# EAGLE design vip (EAGLE 4.15)
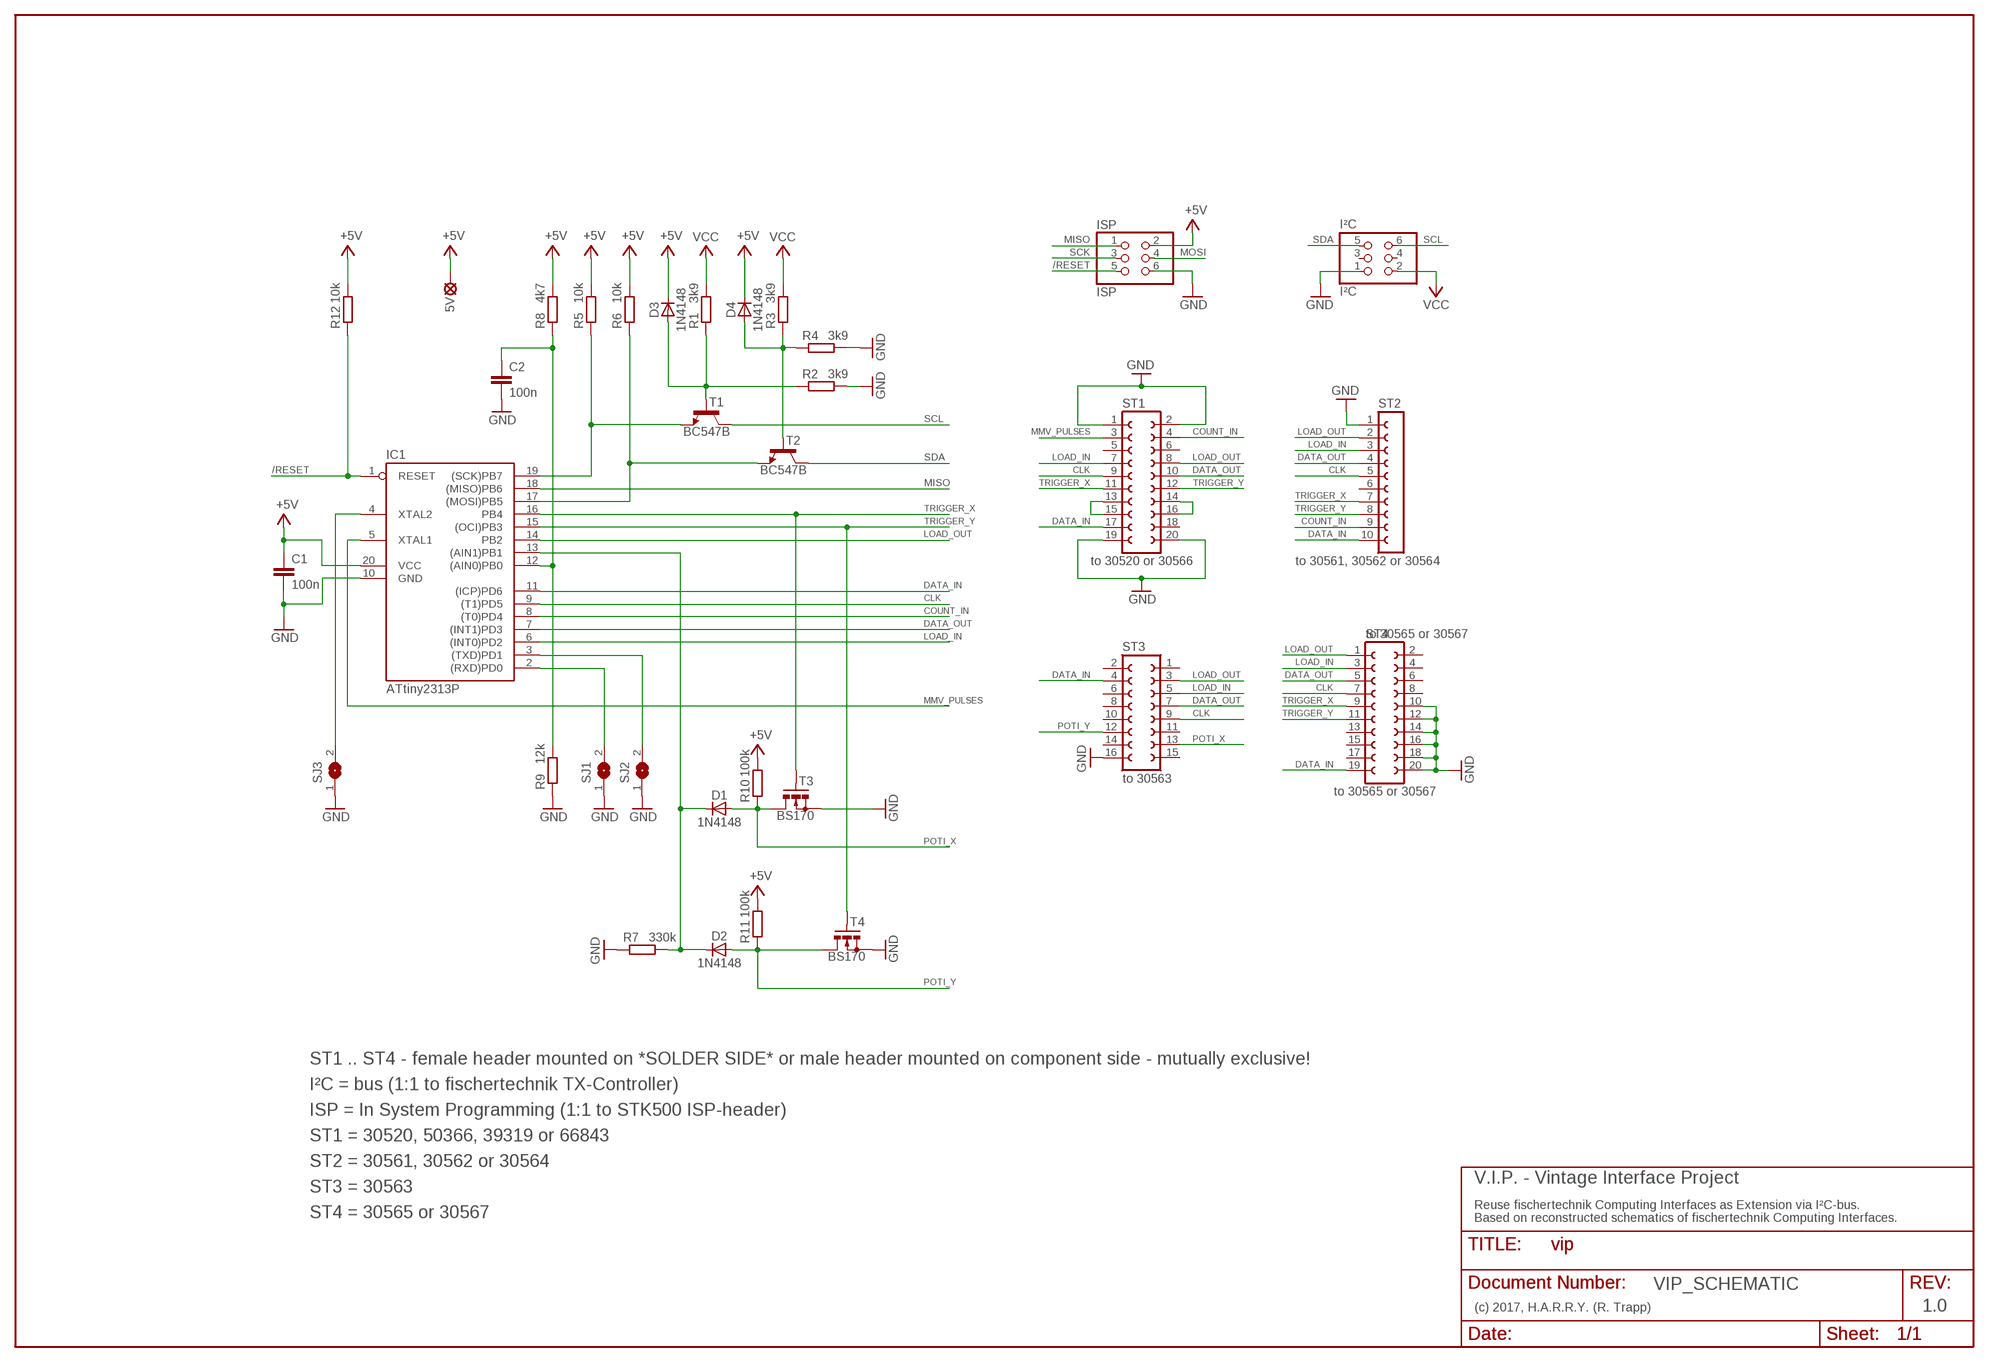
[diagram p0: schematic, sheet 1]

## Parts
5V  LSP10  [LSP10]
C1  100n  C-EU050-024X044  [C050-024X044]
C2  100n  C-EU050-024X044  [C050-024X044]
D1  1N4148  DIODE-D-5  [D-5]
D2  1N4148  DIODE-D-5  [D-5]
D3  1N4148  DIODE-D-5  [D-5]
D4  1N4148  DIODE-D-5  [D-5]
IC1  ATtiny2313P  AT90S2313P  [DIL20]
ISP  ISP  PINHD-2X3_2.54  [2X03]
I²C  I²C  PINHD-2X3_2.54-90°  [2X03/90]
R1  3k9  R-EU_0204/5  [0204/5]
R2  3k9  R-EU_0204/5  [0204/5]
R3  3k9  R-EU_0204/5  [0204/5]
R4  3k9  R-EU_0204/5  [0204/5]
R5  10k  R-EU_0204/5  [0204/5]
R6  10k  R-EU_0204/5  [0204/5]
R7  330k  R-EU_0204/5  [0204/5]
R8  4k7  R-EU_0204/5  [0204/5]
R9  12k  R-EU_0204/5  [0204/5]
R10  100k  R-EU_0204/5  [0204/5]
R11  100k  R-EU_0204/5  [0204/5]
R12  10k  R-EU_0204/2V  [0204V]
SJ1  SJ  [SJ]
SJ2  SJ  [SJ]
SJ3  SJ  [SJ]
ST1  to 30520 or 30566  FE10-2  [FE10-2]
ST2  to 30561, 30562 or 30564  FE10-1  [FE10]
ST3  to 30563  FE08-2  [FE08-2]
ST4  to 30565 or 30567  FE10-2  [FE10-2]
T1  BC547B  [TO92]
T2  BC547B  [TO92]
T3  BS170  [SOT54E]
T4  BS170  [SOT54E]

## Nets
+5V: 5V.MP C1.1 D3.C D4.C IC1.20(VCC) ISP.2 R5.2 R6.2 R8.2 R10.2 R11.2 R12.2
/RESET: IC1.1(RESET) ISP.5 R12.1
CLK: IC1.9((T1)PD5) ST1.9 ST2.5 ST3.9 ST4.7
COUNT_IN: IC1.8((T0)PD4) ST1.4 ST2.9
DATA_IN: IC1.11((ICP)PD6) ST1.17 ST2.10 ST3.4 ST4.19
DATA_OUT: IC1.7((INT1)PD3) ST1.10 ST2.4 ST3.7 ST4.5
GND: C1.2 C2.2 IC1.10(GND) ISP.6 I²C.1 R2.2 R4.2 R7.1 R9.1 SJ1.1 SJ2.1 SJ3.1 ST1.1 ST1.2 ST1.19 ST1.20 ST2.1 ST3.16 ST4.10 ST4.12 ST4.14 ST4.16 ST4.18 ST4.20 T3.S T4.S
LOAD_IN: IC1.6((INT0)PD2) ST1.7 ST2.3 ST3.5 ST4.3
LOAD_OUT: IC1.14(PB2) ST1.8 ST2.2 ST3.3 ST4.1
MISO: IC1.18((MISO)PB6) ISP.1
MMV_PULSES: IC1.5(XTAL1) ST1.3
MOSI: IC1.17((MOSI)PB5) ISP.4 R6.1 T2.1(E)
N$1: D3.A R1.1 R2.1 T1.2(B)
N$2: D4.A R3.1 R4.1 T2.2(B)
N$3: IC1.4(XTAL2) SJ3.2
N$4: IC1.2((RXD)PD0) SJ1.2
N$5: D1.C D2.C IC1.13((AIN1)PB1) R7.2
N$6: IC1.3((TXD)PD1) SJ2.2
N$7: ST1.13 ST1.15
N$8: C2.1 IC1.12((AIN0)PB0) R8.1 R9.2
N$9: ST1.14 ST1.16
POTI_X: D1.A R10.1 ST3.13 T3.D
POTI_Y: D2.A R11.1 ST3.12 T4.D
SCK: IC1.19((SCK)PB7) ISP.3 R5.1 T1.1(E)
SCL: I²C.5 T1.3(C)
SDA: I²C.6 T2.3(C)
TRIGGER_X: IC1.16(PB4) ST1.11 ST2.7 ST4.9 T3.G
TRIGGER_Y: IC1.15((OCI)PB3) ST1.12 ST2.8 ST4.11 T4.G
VCC: I²C.2 R1.2 R3.2
Unconnected: I²C.3 I²C.4 ST1.5 ST1.6 ST1.18 ST2.6 ST3.1 ST3.2 ST3.6 ST3.8 ST3.10 ST3.11 ST3.14 ST3.15 ST4.2 ST4.4 ST4.6 ST4.8 ST4.13 ST4.15 ST4.17

## Notes on the sheet
- to 30565 or 30567
- ST1 .. ST4 - female header mounted on *SOLDER SIDE* or male header mounted on component side - mutually exclusive!
- I²C = bus (1:1 to fischertechnik TX-Controller)
- ISP = In System Programming (1:1 to STK500 ISP-header)
- ST1 = 30520, 50366, 39319 or 66843
- ST2 = 30561, 30562 or 30564
- V.I.P. - Vintage Interface Project
- ST3 = 30563
- Reuse fischertechnik Computing Interfaces as Extension via I²C-bus.
- ST4 = 30565 or 30567
- Based on reconstructed schematics of fischertechnik Computing Interfaces.
- VIP_SCHEMATIC
- (c) 2017, H.A.R.R.Y. (R. Trapp) | 1.0

## Library data of the parts
5V = solpad:LSP10: SOLDER PAD drill 1.0 mm, distributor Buerklin, 12H555
C1 C2 = rcl:C-EU: CAPACITOR, European symbol
D1-D4 = diode:DIODE-: DIODE
IC1 = avr:AT90S2313: MICROCONTROLLER 2 Kbytes FLASH 128 bytes SRAM 128 bytes EEPROM UART
ISP I²C = pinhead-1:PINHD-2X3: PIN HEADER
R1-R12 = rcl:R-EU_: RESISTOR, European symbol
SJ1-SJ3 = jumper:SJ: SMD solder JUMPER
ST1 ST4 = con-lsta:FE10-2: FEMALE HEADER
ST2 = con-lsta:FE10-1: FEMALE HEADER
ST3 = con-lsta:FE08-2: FEMALE HEADER
T1 T2 = transistor-npn:BC547*: NPN Transistor
T3 T4 = transistor-small-signal:BS170: N-CHANNEL MOS FET

## Board
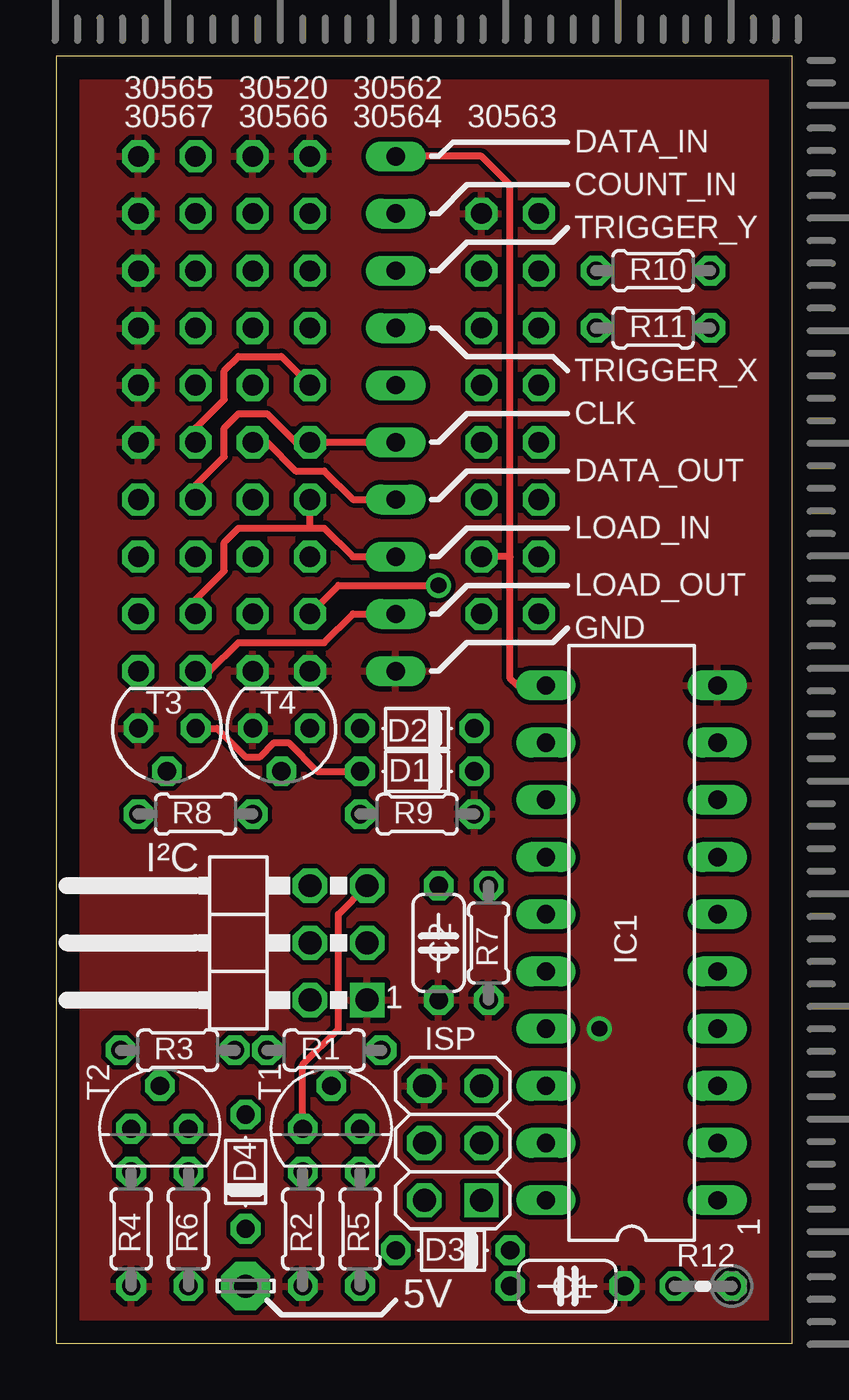
[diagram p1: board, top side]
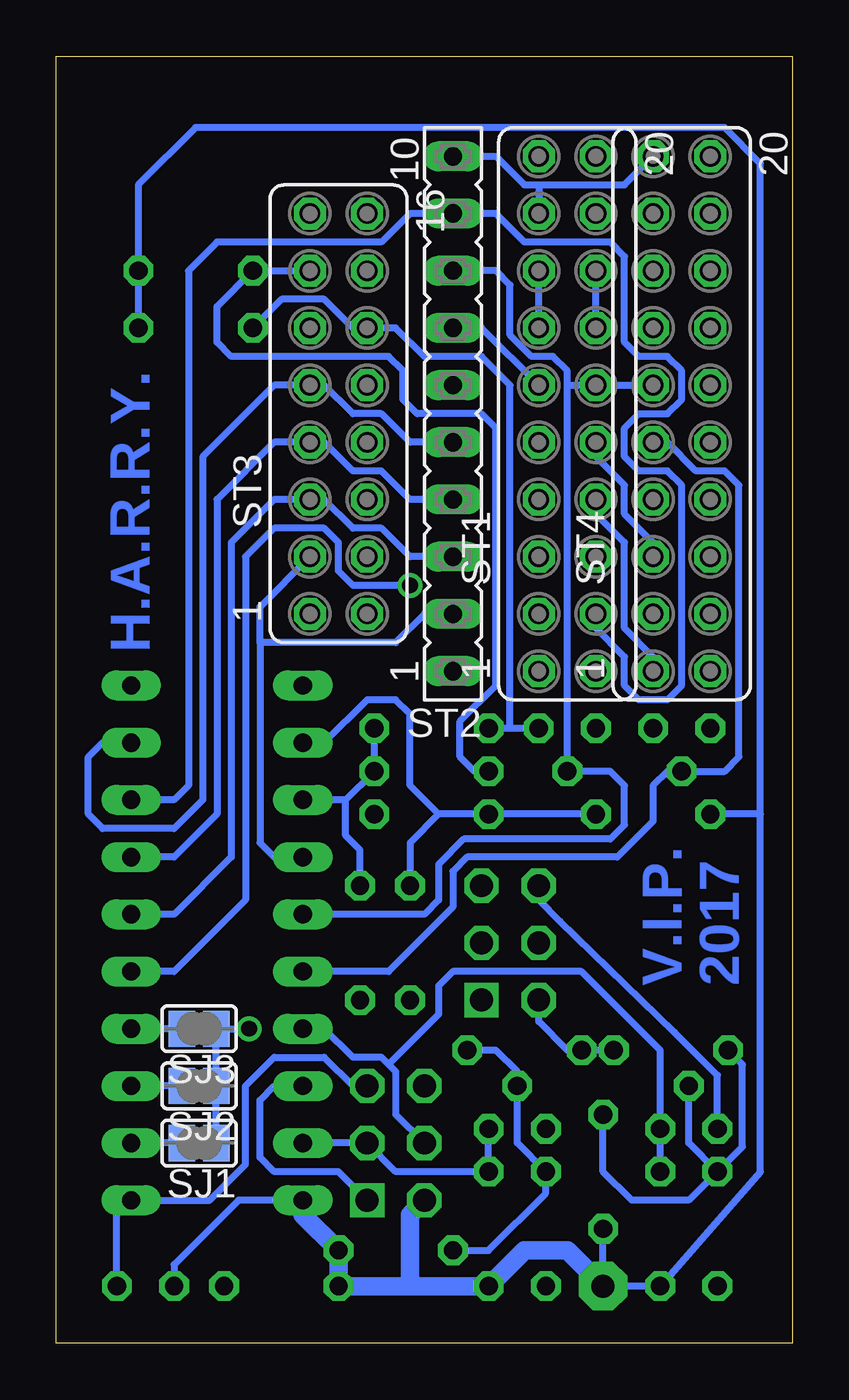
[diagram p2: board, bottom side, seen from below]

Size 32.69 x 57.14 mm. Coordinates in mm from the lower left corner, seen from the top.
Outline: 0,0 32.69,0 32.69,57.14 0,57.14 0,0
Copper layers (1*16): Top 0.035mm / dielectric 1.5mm / Bottom 0.035mm
Design rules "default": minimum track width 10mil, minimum drill 24mil, track to track 8mil, track to pad 8mil, pad to pad 8mil, via to via 8mil, smd to smd 8mil, copper to edge 40mil, drill to drill 8mil, minimum pad ring 10mil, minimum via ring 8mil, stop-mask expansion 4mil, vias tented up to drill 0mil, thermal gap 10mil

### Footprints (pad centres in the part's own frame; a part is rotated, then mirrored left to right if it is on the bottom)
LSP10 = drill 1.016 pad 2.159 octagon: MP 0,0
C050-024X044 = drill 0.813 octagon: 1 -2.54,0; 2 2.54,0
D-5 = drill 0.813 octagon: A 2.54,0; C -2.54,0
DIL20 = drill 0.813 long: 1 -11.43,-3.81; 2 -8.89,-3.81; 3 -6.35,-3.81; 4 -3.81,-3.81; 5 -1.27,-3.81; 6 1.27,-3.81; 7 3.81,-3.81; 8 6.35,-3.81; 9 8.89,-3.81; 10 11.43,-3.81; 11 11.43,3.81; 12 8.89,3.81; 13 6.35,3.81; 14 3.81,3.81; 15 1.27,3.81; 16 -1.27,3.81; 17 -3.81,3.81; 18 -6.35,3.81; 19 -8.89,3.81; 20 -11.43,3.81
2X03 = drill 1.016 square: 1 -2.54,-1.27 | drill 1.016 octagon: 2 -2.54,1.27; 3 0,-1.27; 4 0,1.27; 5 2.54,-1.27; 6 2.54,1.27
2X03/90 = drill 1.016 square: 1 -2.54,-6.35 | drill 1.016 octagon: 2 -2.54,-3.81; 3 0,-6.35; 4 0,-3.81; 5 2.54,-6.35; 6 2.54,-3.81
0204/5 = drill 0.813 octagon: 1 -2.54,0; 2 2.54,0
0204V = drill 0.813 octagon: 1 -1.27,0; 2 1.27,0
SJ = smd 1.168 x 1.6: 1 -0.762,0; 2 0.762,0
FE10-2 = drill 0.914 octagon: 1 -11.43,1.27; 2 -11.43,-1.27; 3 -8.89,1.27; 4 -8.89,-1.27; 5 -6.35,1.27; 6 -6.35,-1.27; 7 -3.81,1.27; 8 -3.81,-1.27; 9 -1.27,1.27; 10 -1.27,-1.27; 11 1.27,1.27; 12 1.27,-1.27; 13 3.81,1.27; 14 3.81,-1.27; 15 6.35,1.27; 16 6.35,-1.27; 17 8.89,1.27; 18 8.89,-1.27; 19 11.43,1.27; 20 11.43,-1.27
FE10 = drill 0.813 long: 1 -11.43,0; 2 -8.89,0; 3 -6.35,0; 4 -3.81,0; 5 -1.27,0; 6 1.27,0; 7 3.81,0; 8 6.35,0; 9 8.89,0; 10 11.43,0
FE08-2 = drill 0.914 octagon: 1 -8.89,1.27; 2 -8.89,-1.27; 3 -6.35,1.27; 4 -6.35,-1.27; 5 -3.81,1.27; 6 -3.81,-1.27; 7 -1.27,1.27; 8 -1.27,-1.27; 9 1.27,1.27; 10 1.27,-1.27; 11 3.81,1.27; 12 3.81,-1.27; 13 6.35,1.27; 14 6.35,-1.27; 15 8.89,1.27; 16 8.89,-1.27
TO92 = drill 0.813 octagon: 1 1.27,0; 2 0,1.905; 3 -1.27,0
SOT54E = drill 0.813 octagon: D -1.27,0; G 0,1.905; S 1.27,0

### Placement (x,y rotation side)
5V  8.41,2.54 0 top
C1  22.7,2.54 0 top
C2  16.98,17.77 270 top
D1  16.03,25.39 180 top
D2  16.03,27.3 180 top
D3  17.61,4.12 180 top
D4  8.41,7.62 90 top
IC1  25.55,17.77 90 top
ISP  17.61,8.89 90 top
I²C  7.46,17.77 90 top
R1  11.9,13.01 180 top
R2  10.95,5.08 270 top
R3  5.39,13.01 0 top
R4  3.33,5.08 270 top
R5  13.49,5.08 270 top
R6  5.87,5.08 270 top
R7  19.2,17.77 90 top
R8  6.18,23.49 180 top
R9  16.03,23.49 180 top
R10  26.5,47.62 0 top
R11  26.5,45.08 0 top
R12  28.73,2.54 180 top
SJ1  26.35,8.89 180 bottom
SJ2  26.35,11.43 180 bottom
SJ3  26.35,13.97 180 bottom
ST1  10,41.27 90 bottom
ST2  15.08,41.27 90 bottom
ST3  20.15,41.27 90 bottom
ST4  4.92,41.27 90 bottom
T1  12.22,9.52 0 top
T2  4.6,9.52 0 top
T3  4.92,27.3 180 top
T4  10,27.3 180 top

### Tracks (layer width: path | path; a pad name or v marks a point on that pad's centre or on a via)
+5V
  Bottom 0.305: 1.42,23.49 1.42,7.62 R6.2 5V.MP D4.C | 1.42,23.49 R8.2 | 1.42,23.49 1.42,52.38 3.01,53.97 26.5,53.97 29.04,51.43 R10.2 R11.2 | R12.2 27.46,3.49 24.6,6.34 IC1.20
  Bottom 0.813: 16.98,2.54 R5.2 11.9,4.12 10,4.12 5V.MP | 16.98,2.54 C1.1 D3.C 21.74,5.71 IC1.20 | ISP.2 16.98,5.71 16.98,2.54
/RESET
  Bottom 0.305: ISP.5 19.52,11.43 20.79,12.7 23.01,12.7 24.28,11.43 24.28,7.93 25.87,6.34 IC1.1 30,5.71 R12.1
CLK
  Top 0.305: ST2.5 ST1.9 10.63,40 9.36,41.27 8.09,41.27 7.46,40.64 7.46,39.37 6.18,38.1 ST4.7
  Bottom 0.305: ST2.5 16.98,40 18.25,41.27 19.52,41.27 20.79,42.54 ST3.9 23.01,42.54 26.19,39.37 26.19,24.12 27.46,22.86 30.63,22.86 31.27,23.49 31.27,26.03 30.63,26.66 IC1.9
COUNT_IN
  Bottom 0.305: ST1.4 8.73,31.74 7.46,30.47 7.46,29.2 6.82,28.57 5.55,28.57 4.92,29.2 4.92,38.1 5.55,38.73 6.82,38.73 7.46,39.37 7.46,40.64 6.82,41.27 5.55,41.27 4.92,41.91 4.92,43.18 5.55,43.81 6.82,43.81 7.46,44.45 7.46,48.26 8.09,48.89 11.9,48.89 13.17,50.16 ST2.9 16.98,50.16 18.25,48.89 25.55,48.89 26.82,47.62 26.82,24.76 27.46,24.12 IC1.8
DATA_IN
  Top 0.305: ST2.10 18.88,52.7 20.15,51.43 20.15,34.92 | 20.15,34.92 ST3.4 | 20.15,34.92 20.15,29.52 20.47,29.2 IC1.11
  Bottom 0.305: ST4.19 7.46,51.43 11.27,51.43 | 11.27,51.43 ST1.17 | 11.27,51.43 11.9,51.43 13.17,52.7 ST2.10
DATA_OUT
  Top 0.305: ST2.4 13.17,37.46 11.9,38.73 10.63,38.73 9.36,40 ST1.10
  Bottom 0.305: ST2.4 16.98,37.46 18.25,38.73 19.52,38.73 20.79,40 ST3.7 23.01,40 25.55,37.46 25.55,23.49 27.46,21.58 IC1.7 | ST4.5 6.18,35.55 7.46,36.83 7.46,38.1 8.73,39.37 ST1.10
GND  (via drill 0.7)
  Bottom 0.305: SJ1.1 SJ2.1 SJ3.1 v24.12,13.97
  pour Top: 0.47,56.51 0.47,0.63 32.22,0.63 32.22,56.51
LOAD_IN
  Top 0.305: ST2.3 13.17,34.92 11.9,36.19 11.27,36.19 | ST4.3 6.18,33.02 7.46,34.29 7.46,35.55 8.09,36.19 11.27,36.19 | 11.27,36.19 ST1.7
  Bottom 0.305: ST2.3 16.98,34.92 18.25,36.19 19.52,36.19 20.79,37.46 ST3.5 23.01,37.46 24.92,35.55 24.92,21.58 27.46,19.04 IC1.6
LOAD_OUT
  Top 0.305: ST2.2 13.17,32.38 11.9,31.11 8.09,31.11 6.82,29.84 ST4.1
  Bottom 0.305: IC1.14 23.01,21.58 23.65,22.22 23.65,31.11 | ST1.8 8.73,36.83 7.46,35.55 7.46,31.74 6.18,30.47 ST4.1 | ST2.2 16.34,32.38 17.61,31.11 23.65,31.11 | 23.65,31.11 23.65,32.7 ST3.3
MISO
  Bottom 0.305: IC1.18 23.01,11.43 23.65,10.79 23.65,8.25 23.01,7.62 20.15,7.62 ISP.1
MMV_PULSES  (via drill 0.7)
  Top 0.305: v16.98,33.65 12.54,33.65 ST1.3
  Bottom 0.305: v16.98,33.65 19.52,33.65 20.15,34.29 20.15,35.55 20.79,36.19 23.01,36.19 24.28,34.92 24.28,19.68 27.46,16.5 IC1.5
MOSI
  Bottom 0.305: 17.93,12.38 17.61,12.06 17.61,10.16 ISP.4 | 17.93,12.38 18.25,12.7 19.52,12.7 20.79,13.97 IC1.17 | R6.1 T2.1 5.87,13.01 9.36,16.5 15.08,16.5 15.71,15.87 15.71,14.6 17.93,12.38
N$1
  Bottom 0.305: R1.1 13.17,13.01 12.22,12.06 T1.2 12.22,8.89 R2.1 10.95,6.66 13.49,4.12 D3.A
N$2
  Bottom 0.305: T2.2 4.6,8.89 R4.1 | D4.A 8.41,7.62 7.14,6.34 4.6,6.34 R4.1 | R3.1 2.22,12.38 2.22,8.73 R4.1
N$3
  Bottom 0.305: SJ3.2 IC1.4
N$4
  Bottom 0.305: SJ1.2 IC1.2
N$5
  Bottom 0.305: 19.84,24.12 D1.C D2.C | 19.84,24.12 IC1.13 | 19.84,24.12 19.84,22.54 19.2,21.9 R7.2
N$6
  Bottom 0.305: SJ2.2 IC1.3
N$7
  Bottom 0.305: ST1.13 ST1.15
N$8
  Bottom 0.305: R8.1 R9.2 15.71,23.49 | 15.71,23.49 16.98,22.22 C2.1 | IC1.12 20.79,26.66 18.88,28.57 17.61,28.57 16.98,27.93 16.98,24.76 15.71,23.49
N$9
  Bottom 0.305: ST1.14 ST1.16
POTI_X
  Top 0.305: T3.D 7.14,27.3 8.41,26.03 9.04,26.03 9.68,26.66 10.31,26.66 11.58,25.39 D1.A
  Bottom 0.305: D1.A 14.12,25.39 14.76,26.03 14.76,27.62 13.17,29.2 13.17,40.64 13.81,41.27 16.66,41.27 17.3,41.91 17.3,43.18 17.93,43.81 24.92,43.81 25.55,44.45 25.55,46.03 R10.1 ST3.13
POTI_Y
  Bottom 0.305: 12.54,27.3 12.54,42.54 13.81,43.81 16.34,43.81 17.61,45.08 ST3.12 19.52,45.08 20.79,46.35 22.7,46.35 R11.1 | T4.D 12.54,27.3 | 12.54,27.3 D2.A
SCK
  Bottom 0.305: T1.1 R5.1 17.61,7.62 ISP.3 IC1.19
SCL
  Top 0.305: T1.3 10.95,12.38 12.54,13.97 12.54,19.04 I²C.5
SDA
  Bottom 0.305: T2.3 3.33,11.9 5.23,13.81 10.31,18.73 11.27,19.68 I²C.6
TRIGGER_X
  Top 0.305: ST4.9 6.18,40.64 7.46,41.91 7.46,43.18 8.09,43.81 10,43.81 ST1.11
  Bottom 0.305: ST2.7 13.81,45.08 ST1.11 | ST4.9 5.55,40 4.28,38.73 3.01,38.73 2.38,38.1 2.38,26.03 3.01,25.39 T3.G 5.55,25.39 6.18,24.76 6.18,23.17 7.77,21.58 14.44,21.58 15.08,20.95 15.08,19.36 17.93,16.5 IC1.16
TRIGGER_Y
  Bottom 0.305: ST4.11 ST1.12 10,42.54 | 10,42.54 T4.G 8.09,25.39 7.46,24.76 7.46,23.01 8.09,22.38 14.6,22.38 15.71,21.27 15.71,19.68 16.34,19.04 IC1.15 | ST2.8 13.17,47.62 12.54,46.98 12.54,44.76 11.58,43.81 10.63,43.81 10,43.18 10,42.54
VCC
  Bottom 0.305: R3.2 R1.2 10,13.01 11.27,14.28 I²C.2

### Text on the board
Bottom: H.A.R.R.Y. | 2017 | V.I.P.
tNames: 30565 | 30520 | 30562 | 30567 | 30566 | 30564 | 30563 | DATA_IN | COUNT_IN | TRIGGER_Y | TRIGGER_X | CLK | DATA_OUT | LOAD_IN | LOAD_OUT | GND | 1 | 1